# EAGLE design Kao Light Test (EAGLE 9.6.2)
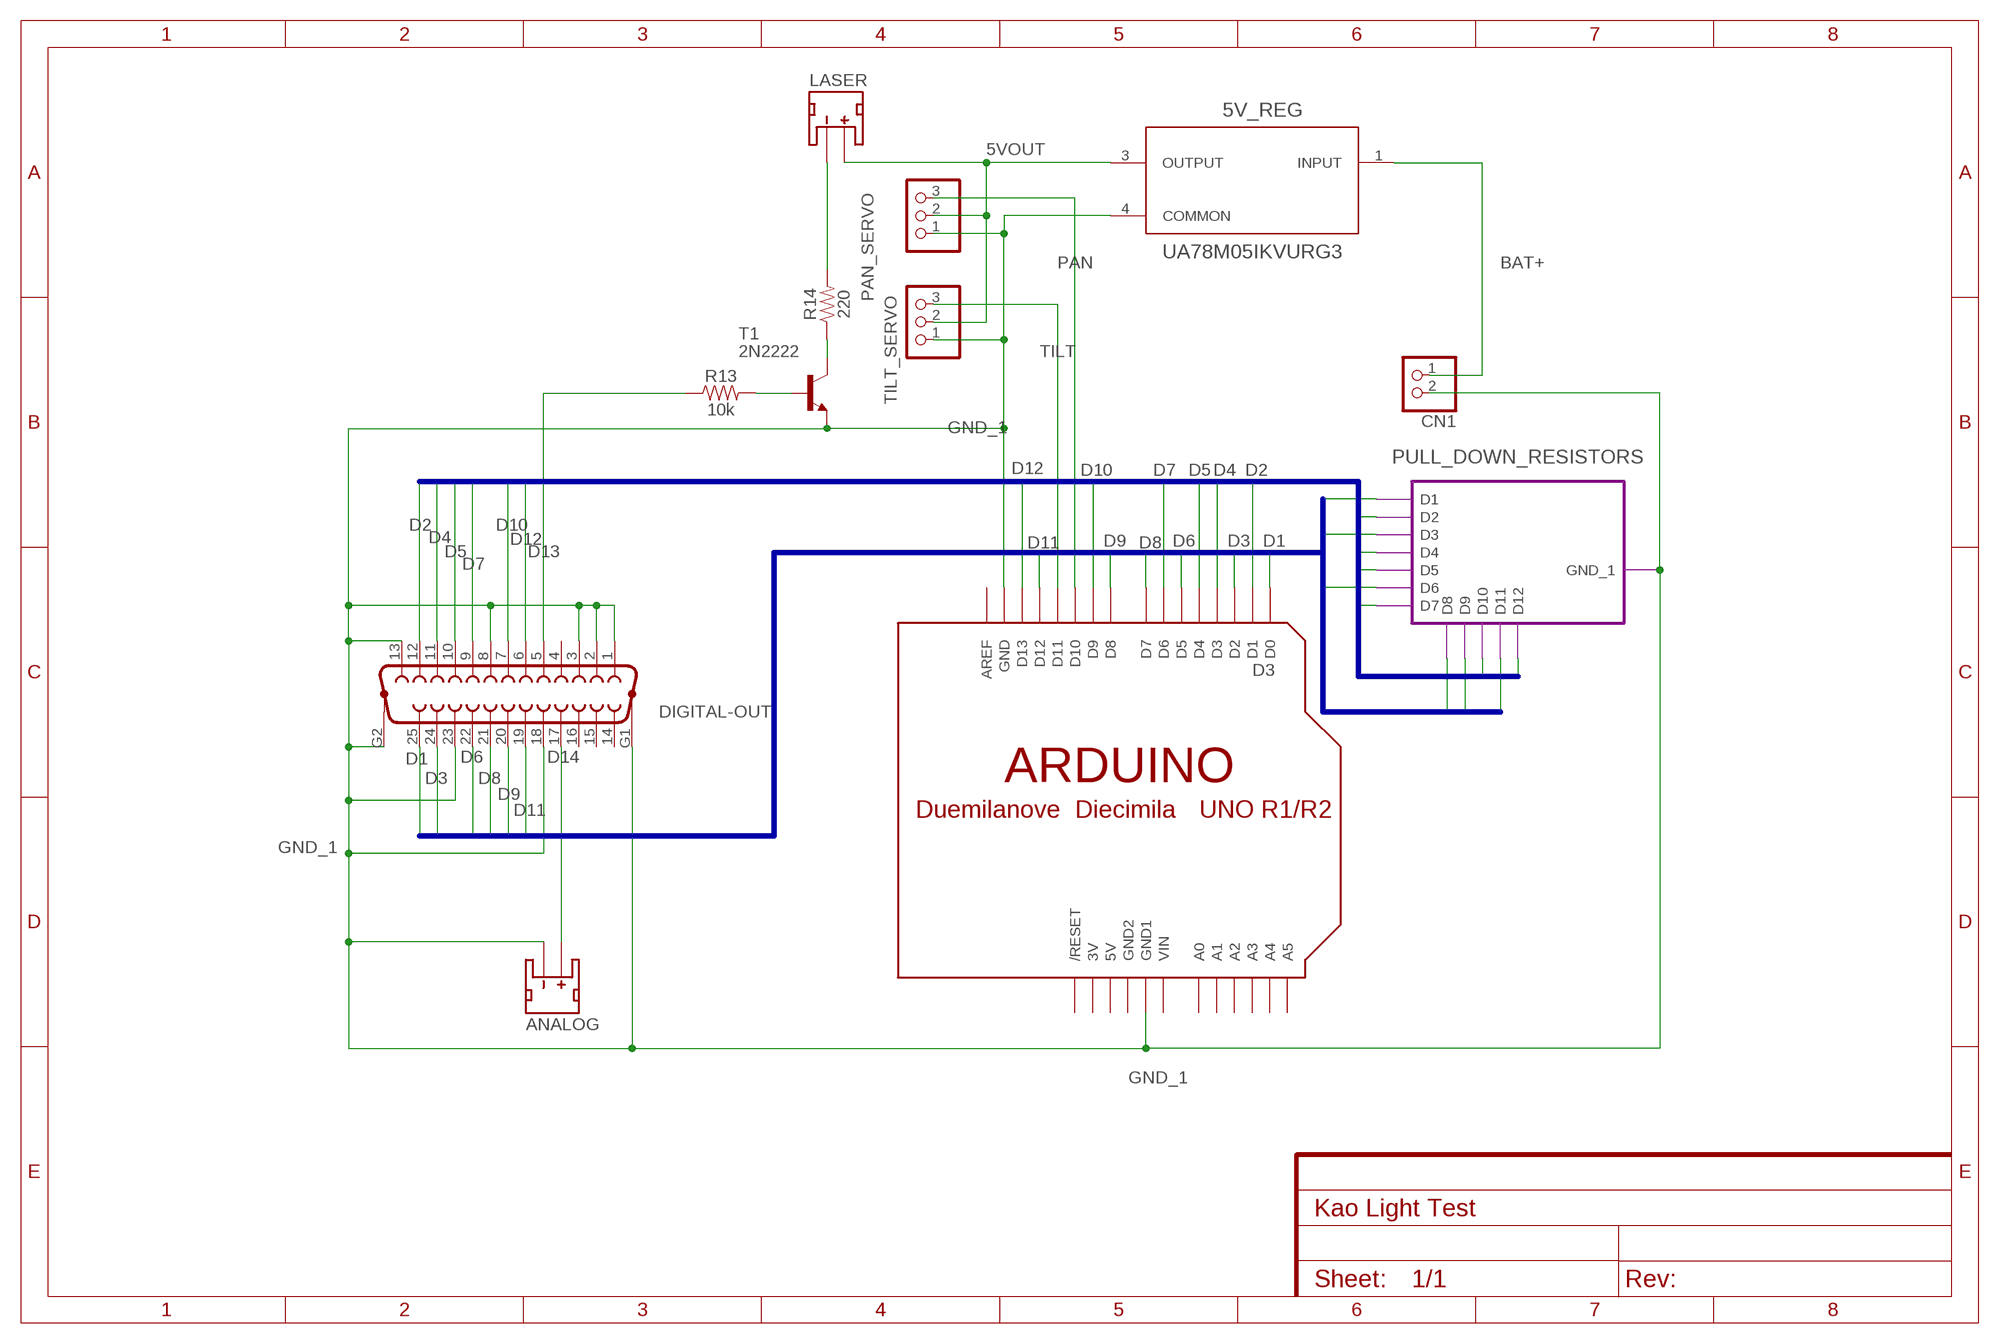
[diagram p0: schematic, sheet 1]

## Parts
5V_REG  UA78M05IKVURG3  [KVU0003A_N]
ANALOG  JST_2MM_MALE  [JST-2-SMD]
CN1  JST_2PIN-THM  [JST-PH-2-THM]
DIGITAL-OUT  F25VP  [F25VP]
LASER  JST_2MM_MALE  [JST-2-SMD]
PAN_SERVO  PINHD-1X3CB  [1X03-CLEANBIG]
R13  10k  10KOHM-HORIZ-1/4W-1%  [AXIAL-0.3]
R14  220  330OHM-HORIZ-1/10W-5%  [AXIAL-0.3]
T1  2N2222  [TO92-EBC-OVAL]
TILT_SERVO  PINHD-1X3CB  [1X03-CLEANBIG]
U$1  ARDUINOUNO  [ARDUINO]

## Module instances
PULL_DOWN_RESISTORS = PULL_DOWN_RESISTORS

## Nets
5VOUT: 5V_REG.3(OUTPUT) LASER.2(+) PAN_SERVO.2 TILT_SERVO.2
BAT+: 5V_REG.1(INPUT) CN1.1
D1: DIGITAL-OUT.25 U$1.D0 ; port PULL_DOWN_RESISTORS.D1
D2: DIGITAL-OUT.12 U$1.D1 ; port PULL_DOWN_RESISTORS.D2
D3: DIGITAL-OUT.24 U$1.D2 ; port PULL_DOWN_RESISTORS.D3
D4: DIGITAL-OUT.11 U$1.D3 ; port PULL_DOWN_RESISTORS.D4
D5: DIGITAL-OUT.10 U$1.D4 ; port PULL_DOWN_RESISTORS.D5
D6: DIGITAL-OUT.22 U$1.D5 ; port PULL_DOWN_RESISTORS.D6
D7: DIGITAL-OUT.9 U$1.D6 ; port PULL_DOWN_RESISTORS.D7
D8: DIGITAL-OUT.21 U$1.D7 ; port PULL_DOWN_RESISTORS.D8
D9: DIGITAL-OUT.20 U$1.D8 ; port PULL_DOWN_RESISTORS.D9
D10: DIGITAL-OUT.7 U$1.D9 ; port PULL_DOWN_RESISTORS.D10
D11: DIGITAL-OUT.19 U$1.D12 ; port PULL_DOWN_RESISTORS.D11
D12: DIGITAL-OUT.6 U$1.D13 ; port PULL_DOWN_RESISTORS.D12
D13: DIGITAL-OUT.5 R13.P$1
D14: ANALOG.2(+) DIGITAL-OUT.17
GND_1: 5V_REG.4(COMMON) ANALOG.1(-) CN1.2 DIGITAL-OUT.1 DIGITAL-OUT.2 DIGITAL-OUT.3 DIGITAL-OUT.8 DIGITAL-OUT.13 DIGITAL-OUT.18 DIGITAL-OUT.23 DIGITAL-OUT.G1 DIGITAL-OUT.G2 PAN_SERVO.1 T1.E TILT_SERVO.1 U$1.GND U$1.GND1 ; port PULL_DOWN_RESISTORS.GND_1
N$2: R13.P$2 T1.B
N$3: R14.P$1 T1.C
N$6: LASER.1(-) R14.P$2
PAN: PAN_SERVO.3 U$1.D10
TILT: TILT_SERVO.3 U$1.D11
Unconnected: ANALOG.NC1(PAD1) ANALOG.NC2(PAD2) DIGITAL-OUT.4 DIGITAL-OUT.14 DIGITAL-OUT.15 DIGITAL-OUT.16 LASER.NC1(PAD1) LASER.NC2(PAD2) U$1.A0 U$1.A1 U$1.A2 U$1.A3 U$1.A4 U$1.A5 U$1.AREF U$1.RESET(/RESET)

## Buses
TOP_DIGITAL_OUTPUTS:D2,D4,D5,D7,D10,D12
BOTTOM_DIGITAL_OUTPUTS:D1,D3,D6,D8,D9,D11

## Power pins joined to a net without a drawn wire
3V: U$1.3V
5V: U$1.5V
GND2: U$1.GND2
VIN: U$1.VIN

## Library data of the parts
5V_REG = UA78M05IKVURG3:UA78M05IKVURG3; COPYRIGHT: Copyright (C) 2021 Ultra Librarian. All rights reserved.; DIGI-KEY_PART_NUMBER_1: 296-21206-1-ND; DIGI-KEY_PART_NUMBER_2: 296-21206-2-ND; DIGI-KEY_PART_NUMBER_3: 296-21206-6-ND; DIGI-KEY_PART_NUMBER_4: 2156-UA78M05IKVURG3-ND; MANUFACTURER_PART_NUMBER: UA78M05IKVURG3; MFR_NAME: Texas Instruments; REFDES: RefDes; TYPE: TYPE
ANALOG LASER = SparkFun-Connectors:JST_2MM_MALE: JST 2MM MALE RA CONNECTOR Two pin, compact surface mount connector. Commonly used as a battery input connection point. We really like the solid locking feeling and high current rating on these small connectors. We use these all the time as battery connectors. Mates to single-cell LiPo batteries. Here is the connector we sell at SparkFun: JST Right Angle Connector - White <https://www.sparkfun.com/products/8612> (PRT-08612) Datasheet <http://www.sparkfun.com/datasheets/Prototyping/Connectors/JST-Horizontal.pdf> It was used on these SparkFun products: SparkFun MOSFET Power Controller <https://www.sparkfun.com/products/11214> (PRT-11214) SparkFun Battery Babysitter - LiPo Battery Manager <https://www.sparkfun.com/products/13777> (PRT-13777) And many, many others that required a lipo battery connection.; PROD_ID: CONN-11443; SF_ID: PRT-08612
CN1 = adafruit:JST_2PIN: JST 2-Pin Connectors of various flavors SMT-RA (S2B-PH-SM4) 4UConnector #17311 SMT (B2B-PH-SM4) THM-RA (S2B-PH) THM (B2B-PH)
DIGITAL-OUT = con-subd:F25VP: SUB-D; OC_FARNELL: unknown; OC_NEWARK: unknown
PAN_SERVO TILT_SERVO = adafruit:PINHD-1X3: PIN HEADER
R13 = SparkFun-Resistors:10KOHM: 10kΩ resistor A resistor is a passive two-terminal electrical component that implements electrical resistance as a circuit element. Resistors act to reduce current flow, and, at the same time, act to lower voltage levels within circuits. - Wikipedia; PROD_ID: RES-12183
R14 = SparkFun-Resistors:330OHM: 330Ω resistor A resistor is a passive two-terminal electrical component that implements electrical resistance as a circuit element. Resistors act to reduce current flow, and, at the same time, act to lower voltage levels within circuits. - Wikipedia; PROD_ID: RES-8371; VALUE: 330
T1 = adafruit:2N2222: NPN TRANSISTOR Big oval pads
U$1 = adafruit:ARDUINO: Arduino Diecimila/Duemilanove Make a shield with ease, this package has all the named pins as well as the two mounting drill holes and an outline of the USB and DC power connector. The outline is on the DIMENSION layer, so if your board house uses it they will cut the outline to match. http://www.ladyada.net/library/pcb/eaglelibrary.html

## Module PULL_DOWN_RESISTORS
Ports: D1(in) D2(in) D3(in) D4(in) D5(in) D6(in) D7(in) D8(in) D9(in) D10(in) D11(in) D12(in) GND_1(out)
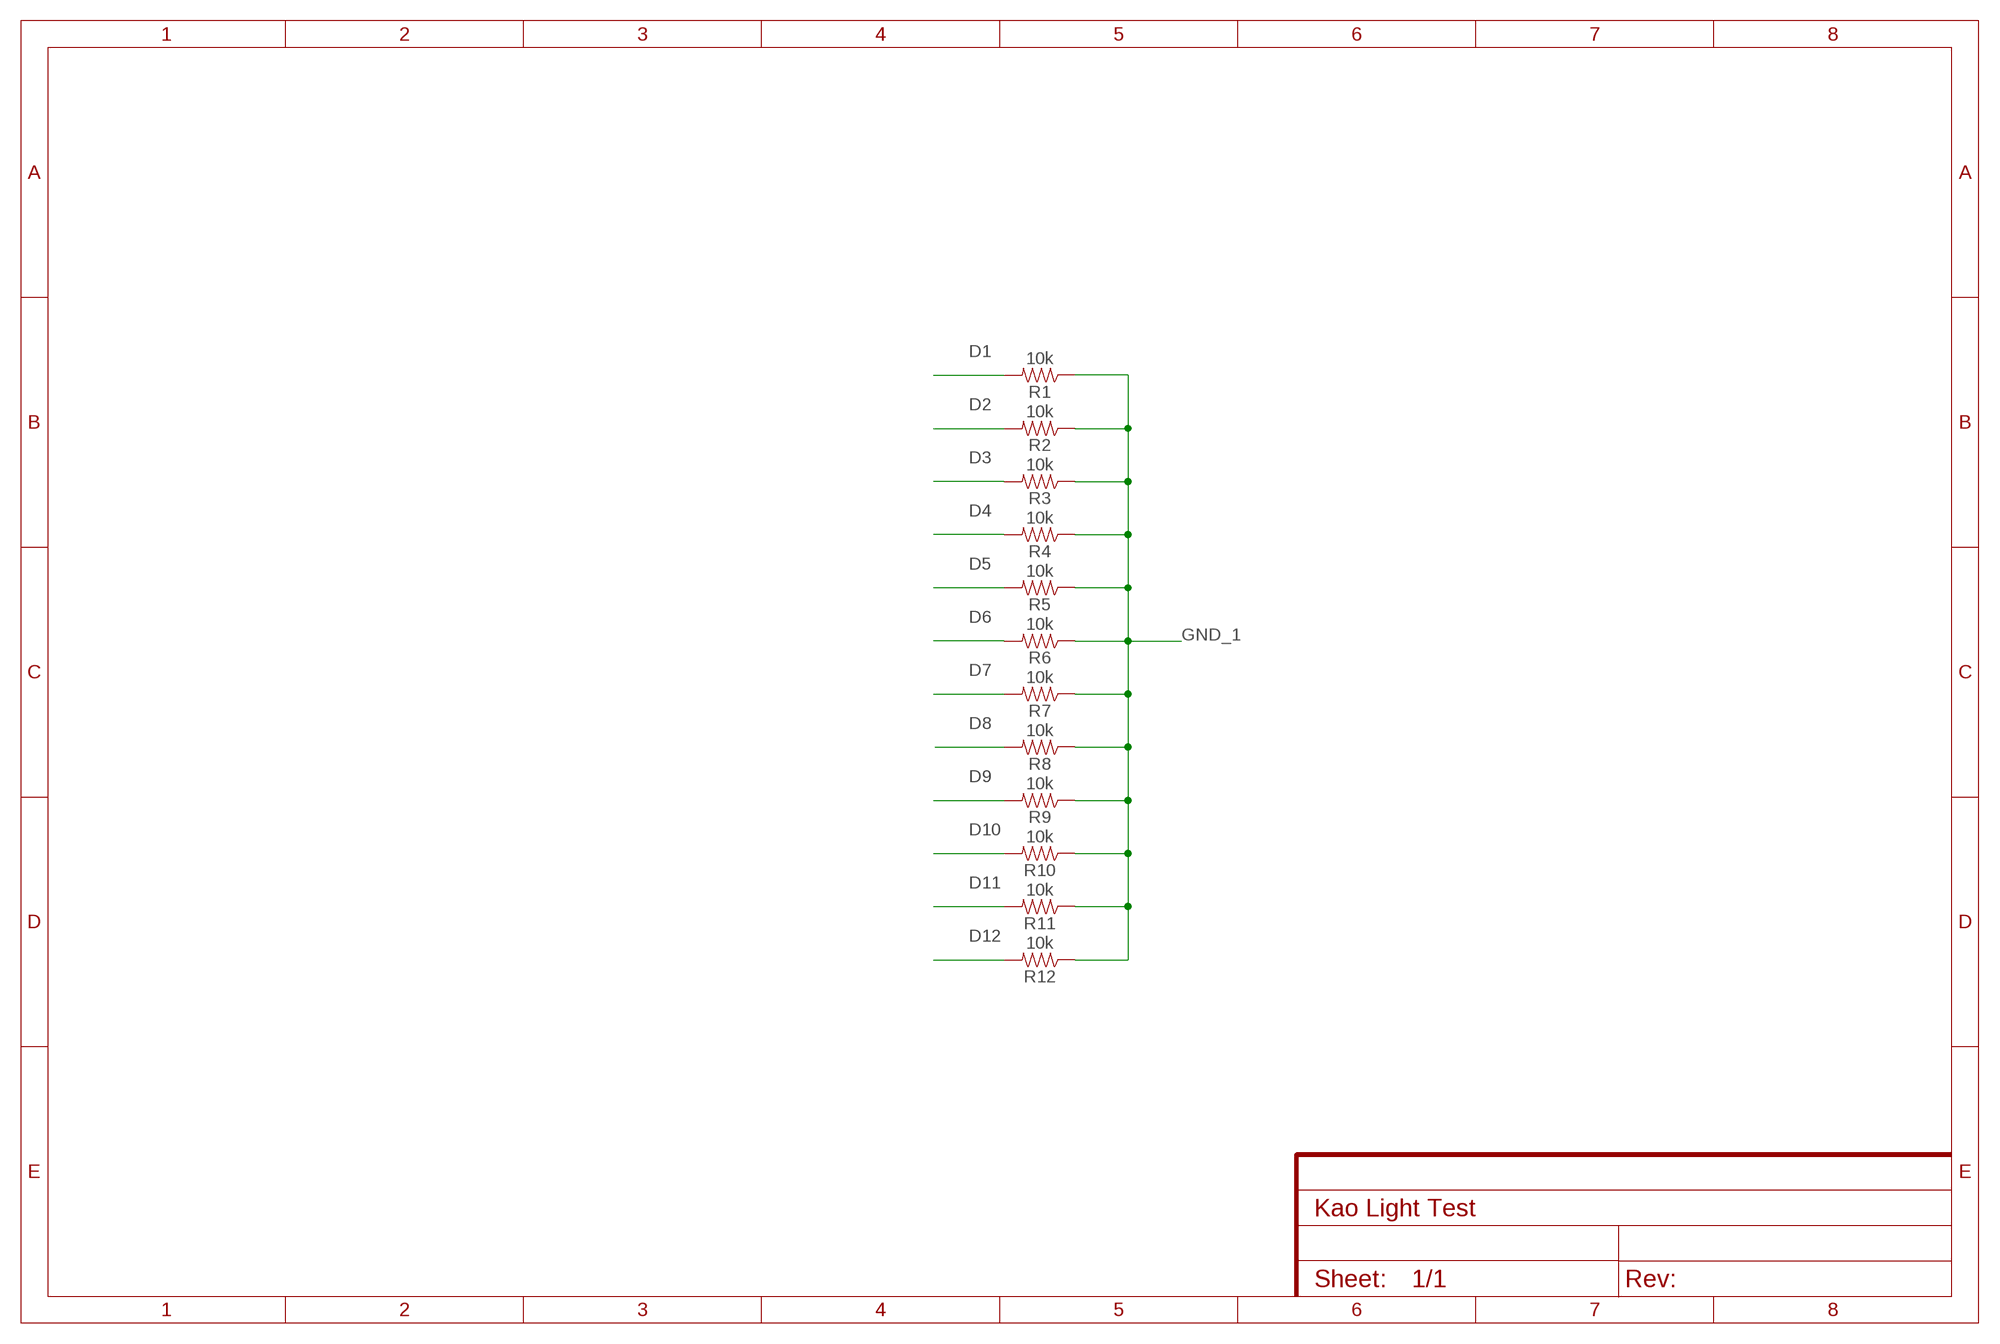
[diagram p1: schematic, module PULL_DOWN_RESISTORS, sheet 1]

### Parts
R1  10k  1KOHM-HORIZ-1/4W-1%  [AXIAL-0.3]
R2  10k  1KOHM-HORIZ-1/4W-1%  [AXIAL-0.3]
R3  10k  1KOHM-HORIZ-1/4W-1%  [AXIAL-0.3]
R4  10k  1KOHM-HORIZ-1/4W-1%  [AXIAL-0.3]
R5  10k  1KOHM-HORIZ-1/4W-1%  [AXIAL-0.3]
R6  10k  1KOHM-HORIZ-1/4W-1%  [AXIAL-0.3]
R7  10k  1KOHM-HORIZ-1/4W-1%  [AXIAL-0.3]
R8  10k  1KOHM-HORIZ-1/4W-1%  [AXIAL-0.3]
R9  10k  1KOHM-HORIZ-1/4W-1%  [AXIAL-0.3]
R10  10k  1KOHM-HORIZ-1/4W-1%  [AXIAL-0.3]
R11  10k  1KOHM-HORIZ-1/4W-1%  [AXIAL-0.3]
R12  10k  1KOHM-HORIZ-1/4W-1%  [AXIAL-0.3]

### Nets
D1: R1.P$2
D2: R2.P$2
D3: R3.P$2
D4: R4.P$2
D5: R5.P$2
D6: R6.P$2
D7: R7.P$2
D8: R8.P$2
D9: R9.P$2
D10: R10.P$2
D11: R11.P$2
D12: R12.P$2
GND_1: R1.P$1 R2.P$1 R3.P$1 R4.P$1 R5.P$1 R6.P$1 R7.P$1 R8.P$1 R9.P$1 R10.P$1 R11.P$1 R12.P$1

### Library data of the parts
R1-R12 = SparkFun-Resistors:1KOHM: 1kΩ resistor A resistor is a passive two-terminal electrical component that implements electrical resistance as a circuit element. Resistors act to reduce current flow, and, at the same time, act to lower voltage levels within circuits. - Wikipedia; PROD_ID: RES-12182; VALUE: 1k

## Net classes
0 default: width 0.406 mm

## Board
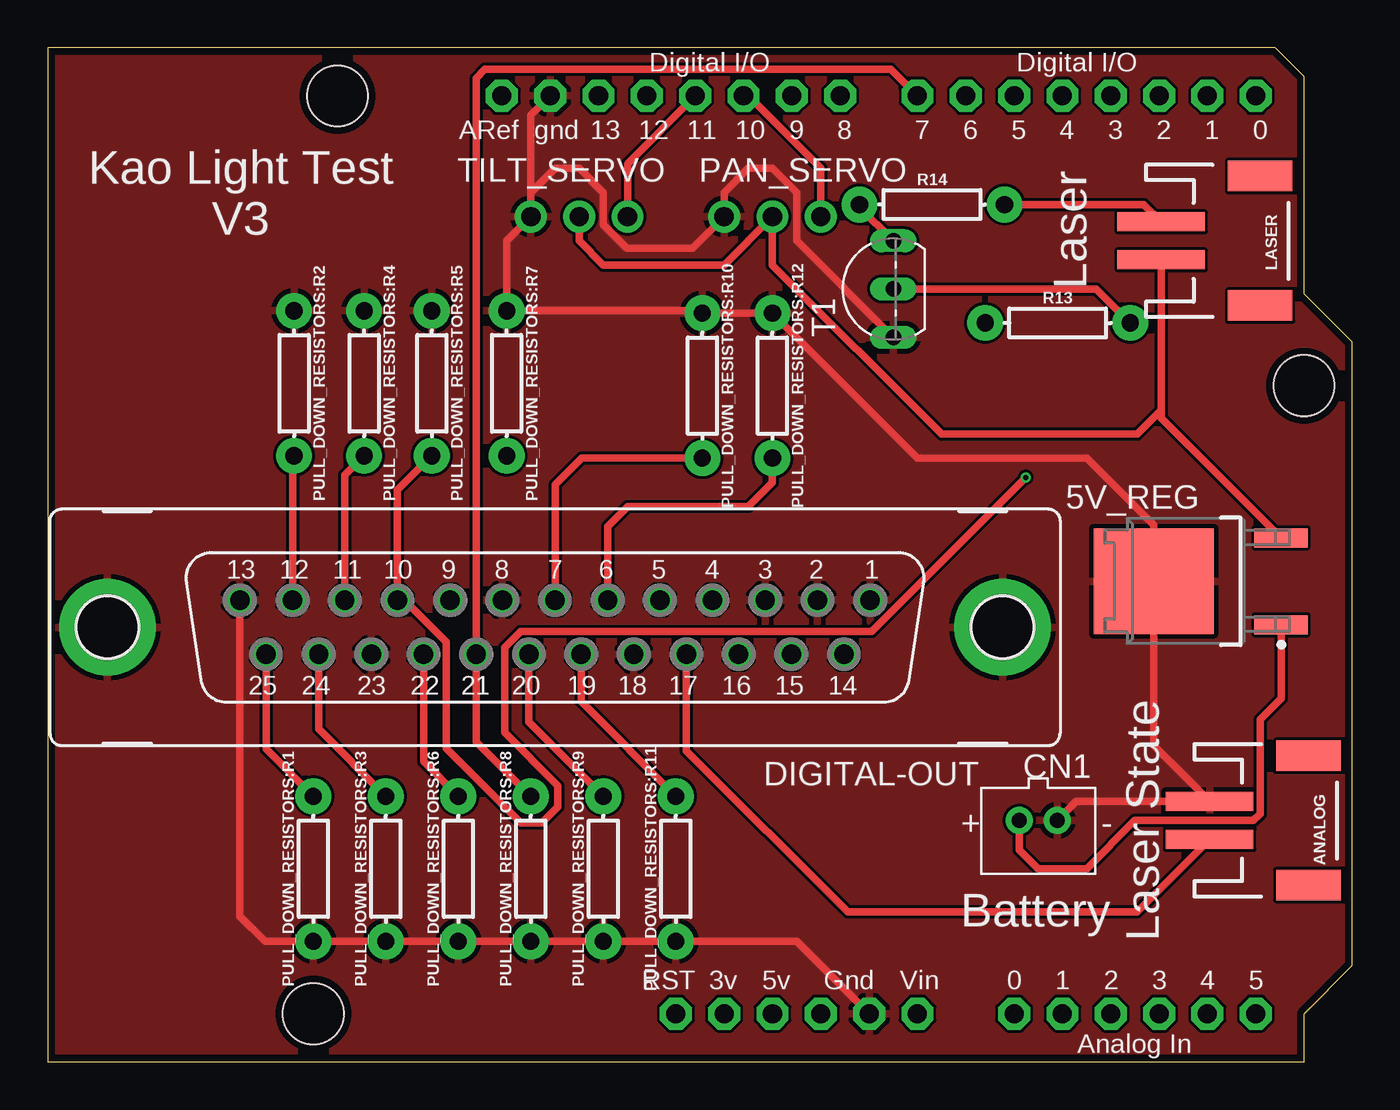
[diagram p2: board, top side]
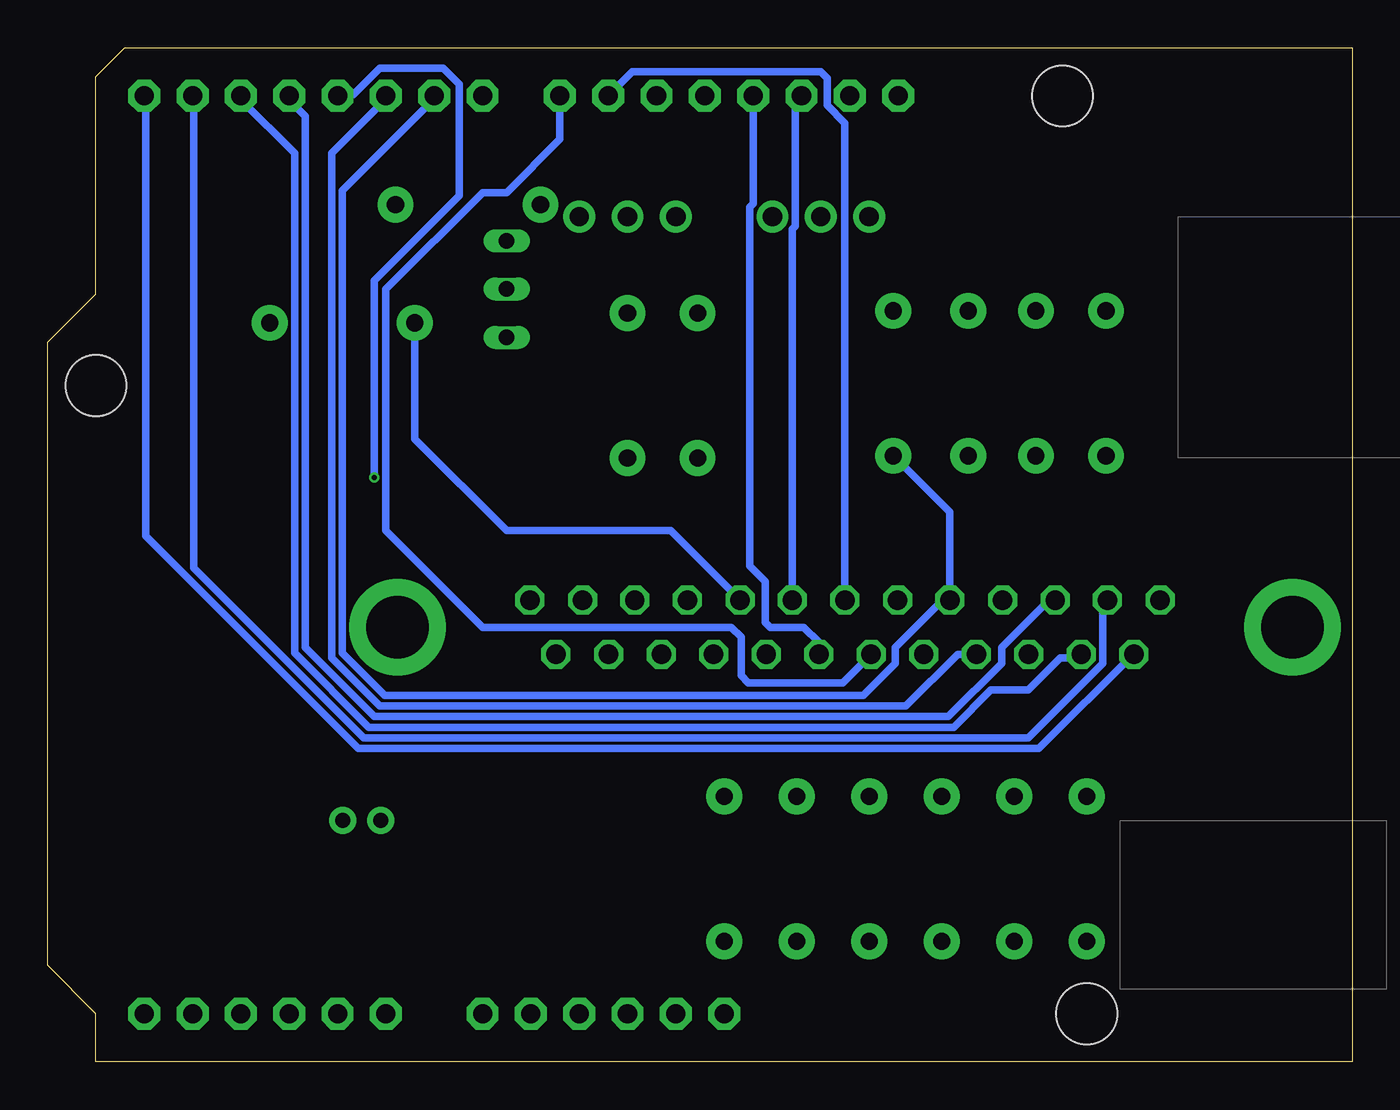
[diagram p3: board, bottom side, seen from below]

Size 68.58 x 53.34 mm. Coordinates in mm from the lower left corner, seen from the top.
Copper layers (1*16): Top 0.035559375mm / dielectric 1.6mm / Bottom 0.035559375mm
Design rules "oshpark-2layer": minimum track width 6mil, minimum drill 10mil, track to track 6mil, track to pad 6mil, pad to pad 6mil, via to via 6mil, smd to smd 6mil, copper to edge 15mil, drill to drill 6mil, minimum pad ring 5mil, minimum via ring 5mil, stop-mask expansion 2.5mil, vias tented up to drill 0mil, thermal gap 10mil

### Footprints (pad centres in the part's own frame; a part is rotated, then mirrored left to right if it is on the bottom)
KVU0003A_N = smd 2.8 x 1: 1 -3.87,2.29; 3 -3.87,-2.29 | smd 6.3 x 5.55: 4 2.83,0
JST-2-SMD = smd 1 x 4.6: 1 -1,-3.7; 2 1,-3.7 | smd 1.6 x 3.4: NC1 -3.4,1.5; NC2 3.4,1.5
JST-PH-2-THM = drill 0.8 pad 1.422: 1 1,0; 2 -1,0
F25VP = drill 1.016 octagon: 1 16.561,1.422; 2 13.792,1.422; 3 11.049,1.422; 4 8.28,1.422; 5 5.512,1.422; 6 2.769,1.422; 7 0,1.422; 8 -2.769,1.422; 9 -5.512,1.422; 10 -8.28,1.422; 11 -11.049,1.422; 12 -13.792,1.422; 13 -16.561,1.422; 14 15.189,-1.422; 15 12.421,-1.422; 16 9.652,-1.422; 17 6.909,-1.422; 18 4.14,-1.422; 19 1.372,-1.422; 20 -1.372,-1.422; 21 -4.14,-1.422; 22 -6.909,-1.422; 23 -9.652,-1.422; 24 -12.421,-1.422; 25 -15.189,-1.422 | drill 3.302 pad 5.08: G1 -23.52,0; G2 23.52,0
1X03-CLEANBIG = drill 1.016 pad 1.676: 1 -2.54,0; 2 0,0; 3 2.54,0
AXIAL-0.3 = drill 0.9 pad 1.88: P$1 -3.81,0; P$2 3.81,0
TO92-EBC-OVAL = drill 0.813 long: B 0,-1.27; C 2.54,-1.27; E -2.54,-1.27
ARDUINO = drill 1 pad 1.676 octagon: 3V 35.56,2.54; 5V 38.1,2.54; A0 50.8,2.54; A1 53.34,2.54; A2 55.88,2.54; A3 58.42,2.54; A4 60.96,2.54; A5 63.5,2.54; AREF 23.876,50.8; D0 63.5,50.8; D1 60.96,50.8; D2 58.42,50.8; D3 55.88,50.8; D4 53.34,50.8; D5 50.8,50.8; D6 48.26,50.8; D7 45.72,50.8; D8 41.656,50.8; D9 39.116,50.8; D10 36.576,50.8; D11 34.036,50.8; D12 31.496,50.8; D13 28.956,50.8; GND 26.416,50.8; GND1 43.18,2.54; GND2 40.64,2.54; RESET 33.02,2.54; VIN 45.72,2.54 | hole 3.2: 15.24,50.8; 66.04,35.56; 13.97,2.54

### Placement (x,y rotation side)
5V_REG  60.96,25.27 180 top
ANALOG  64.77,12.7 270 top
CN1  52.07,12.7 180 top
DIGITAL-OUT  26.67,22.86 0 top
LASER  62.23,43.18 270 top
PAN_SERVO  38.1,44.45 0 top
PULL_DOWN_RESISTORS:R1  10k  [AXIAL-0.3]  13.97,10.16 90 top
PULL_DOWN_RESISTORS:R2  10k  [AXIAL-0.3]  12.95,35.69 270 top
PULL_DOWN_RESISTORS:R3  10k  [AXIAL-0.3]  17.78,10.16 90 top
PULL_DOWN_RESISTORS:R4  10k  [AXIAL-0.3]  16.64,35.69 270 top
PULL_DOWN_RESISTORS:R5  10k  [AXIAL-0.3]  20.19,35.69 270 top
PULL_DOWN_RESISTORS:R6  10k  [AXIAL-0.3]  21.59,10.16 90 top
PULL_DOWN_RESISTORS:R7  10k  [AXIAL-0.3]  24.13,35.69 270 top
PULL_DOWN_RESISTORS:R8  10k  [AXIAL-0.3]  25.4,10.16 90 top
PULL_DOWN_RESISTORS:R9  10k  [AXIAL-0.3]  29.21,10.16 90 top
PULL_DOWN_RESISTORS:R10  10k  [AXIAL-0.3]  34.42,35.56 270 top
PULL_DOWN_RESISTORS:R11  10k  [AXIAL-0.3]  33.02,10.16 90 top
PULL_DOWN_RESISTORS:R12  10k  [AXIAL-0.3]  38.1,35.56 270 top
R13  53.09,38.86 0 top
R14  46.48,45.09 0 top
T1  43.18,40.64 90 top
TILT_SERVO  27.94,44.45 0 top
U$1  0,0 0 top

### Tracks (layer width: path | path; a pad name or v marks a point on that pad's centre or on a via)
5VOUT
  Top 0.406: 5V_REG.3 58.53,33.86 58.53,34.29 | 58.53,34.29 LASER.2 | 58.53,34.29 57.26,33.02 46.99,33.02 38.1,41.91 PAN_SERVO.2 35.56,41.91 29.21,41.91 27.94,43.18 TILT_SERVO.2
BAT+
  Top 0.406: CN1.1 51.07,11.16 52.07,10.16 54.61,10.16 57.15,12.7 63.37,12.7 63.73,13.05 63.73,18.01 64.83,19.11 5V_REG.1
D1
  Top 0.406: PULL_DOWN_RESISTORS:R1.P$2 11.48,16.46 DIGITAL-OUT.25
  Bottom 0.406: U$1.D0 63.42,50.57 63.42,27.66 52.25,16.48 16.48,16.48 11.53,21.44 DIGITAL-OUT.25
D2
  Top 0.406: DIGITAL-OUT.12 12.88,31.57 12.95,31.65 PULL_DOWN_RESISTORS:R2.P$2
  Bottom 0.406: DIGITAL-OUT.12 13.13,24.03 13.13,20.95 17.04,17.04 51.97,17.04 60.91,25.98 60.91,50.57 60.96,50.62 U$1.D1
D3
  Top 0.406: DIGITAL-OUT.24 14.25,17.5 PULL_DOWN_RESISTORS:R3.P$2
  Bottom 0.406: U$1.D2 58.4,50.57 55.6,47.78 55.6,21.51 51.69,17.6 20.95,17.6 19,19.56 17.04,19.56 15.37,21.23 14.25,21.23 DIGITAL-OUT.24
D4
  Top 0.406: DIGITAL-OUT.11 15.62,30.86 PULL_DOWN_RESISTORS:R4.P$2
  Bottom 0.406: DIGITAL-OUT.11 15.65,24.03 16.2,24.03 18.44,21.79 18.44,20.95 21.23,18.16 51.41,18.16 55.04,21.79 55.04,49.73 55.88,50.57 U$1.D3
D5  (via drill 0.25)
  Top 0.406: 19,24.03 18.44,24.03 DIGITAL-OUT.10 | DIGITAL-OUT.10 18.39,30.07 PULL_DOWN_RESISTORS:R5.P$2 | v51.41,30.73 43.31,22.63 24.87,22.63 24.03,21.79 24.03,17.32 26.82,14.53 26.82,13.41 25.98,12.57 24.87,12.57 20.95,16.48 20.95,22.07 19,24.03 | 19,24.03 DIGITAL-OUT.10
  Bottom 0.406: v51.41,30.73 51.41,41.07 46.94,45.54 46.94,51.41 47.78,52.25 51.13,52.25 52.53,50.85 53.09,50.85 53.14,50.8 U$1.D4
D6
  Top 0.406: PULL_DOWN_RESISTORS:R6.P$2 19.76,15.8 DIGITAL-OUT.22
  Bottom 0.406: U$1.D5 50.85,50.57 53.65,47.78 53.65,21.23 51.13,18.72 23.47,18.72 20.75,21.44 DIGITAL-OUT.22
D7
  Bottom 0.406: PULL_DOWN_RESISTORS:R7.P$2 21.16,28.91 DIGITAL-OUT.9 21.23,24.03 21.79,24.03 24.03,21.79 24.03,20.95 25.7,19.28 50.85,19.28 53.09,21.51 53.09,45.82 48.34,50.57 48.34,50.72 U$1.D6
D8
  Top 0.406: U$1.D7 44.32,52.2 22.99,52.2 22.53,51.74 22.53,21.59 DIGITAL-OUT.21 22.53,16.84 PULL_DOWN_RESISTORS:R8.P$2
D9
  Top 0.406: DIGITAL-OUT.20 25.3,17.88 PULL_DOWN_RESISTORS:R9.P$2
  Bottom 0.406: U$1.D8 41.66,48.51 44.45,45.72 45.72,45.72 50.8,40.64 50.8,27.94 45.72,22.86 32.64,22.86 32.13,22.35 32.13,20.32 31.75,19.94 26.8,19.94 DIGITAL-OUT.20
D10
  Top 0.406: DIGITAL-OUT.7 26.67,30.35 28.07,31.75 PULL_DOWN_RESISTORS:R10.P$2
  Bottom 0.406: DIGITAL-OUT.7 26.67,49.37 27.61,50.31 27.61,51.74 27.94,52.07 37.85,52.07 U$1.D9
D11
  Top 0.406: PULL_DOWN_RESISTORS:R11.P$2 28.04,18.95 DIGITAL-OUT.19
  Bottom 0.406: U$1.D12 31.5,45.12 31.67,44.94 31.67,26.09 30.86,25.27 30.86,23.11 30.61,22.86 28.83,22.86 28.04,22.07 DIGITAL-OUT.19
D12
  Top 0.406: DIGITAL-OUT.6 29.44,28.17 30.48,29.21 36.83,29.21 38.1,30.48 PULL_DOWN_RESISTORS:R12.P$2
  Bottom 0.406: DIGITAL-OUT.6 29.44,43.8 29.29,43.96 29.29,50.47 U$1.D13
D13
  Bottom 0.406: R13.P$1 49.28,32.77 44.45,27.94 35.84,27.94 DIGITAL-OUT.5
D14
  Top 0.406: ANALOG.2 57.26,7.89 42.05,7.89 33.58,16.36 DIGITAL-OUT.17
GND_1
  Top 0.406: 25.4,45.72 25.4,49.78 U$1.GND | 25.4,45.72 26.67,46.99 27.94,46.99 29.21,45.72 29.21,44.03 30.44,42.8 33.91,42.8 PAN_SERVO.1 35.56,45.72 36.83,46.99 38.1,46.99 39.37,45.72 39.37,43.18 T1.E | U$1.GND1 39.37,6.35 PULL_DOWN_RESISTORS:R11.P$1 PULL_DOWN_RESISTORS:R9.P$1 PULL_DOWN_RESISTORS:R8.P$1 PULL_DOWN_RESISTORS:R6.P$1 PULL_DOWN_RESISTORS:R3.P$1 PULL_DOWN_RESISTORS:R1.P$1 11.43,6.35 10.11,7.67 DIGITAL-OUT.13 | 25.4,45.72 TILT_SERVO.1 24.13,43.18 PULL_DOWN_RESISTORS:R7.P$1 34.29,39.5 PULL_DOWN_RESISTORS:R10.P$1 PULL_DOWN_RESISTORS:R12.P$1 45.72,31.75 54.61,31.75 58.13,28.23 5V_REG.4 58.13,16.64 ANALOG.1 54.07,13.7 CN1.2
  pour Top: -5.08,55.88 73.66,55.88 74.93,54.61 74.93,0 72.39,-2.54 69.85,-5.08 -7.62,-5.08 -7.62,53.34
N$2
  Top 0.406: R13.P$2 55.12,40.64 T1.B
N$3
  Top 0.406: T1.C 42.67,44.96 R14.P$1
N$6
  Top 0.406: R14.P$2 57.62,45.09 LASER.1
PAN
  Top 0.406: PAN_SERVO.3 40.64,46.99 36.83,50.8 U$1.D10
TILT
  Top 0.406: U$1.D11 30.48,47.24 TILT_SERVO.3

### Text on the board
tNames: Kao Light Test / V3 | Laser | Battery | Laser State